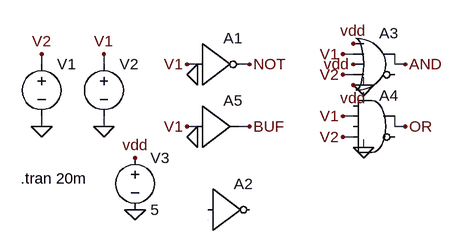
[diagram p0: schematic digitalSimulation.asc]
digitalSimulation.asc, the LTspice schematic file:
Version 4
SHEET 1 880 680
WIRE 64 48 48 48
WIRE -416 64 -416 48
WIRE -320 64 -320 48
WIRE -176 64 -192 64
WIRE -96 64 -112 64
WIRE 128 64 128 48
WIRE 144 64 128 64
WIRE 64 80 48 80
WIRE 64 144 48 144
WIRE -416 160 -416 144
WIRE -320 160 -320 144
WIRE -176 160 -192 160
WIRE -96 160 -112 160
WIRE 128 160 128 144
WIRE 144 160 128 160
WIRE 64 176 48 176
FLAG -192 64 V1
FLAG -192 160 V1
FLAG 48 48 V1
FLAG 48 80 V2
FLAG 48 144 V1
FLAG 48 176 V2
FLAG -96 64 NOT
FLAG -96 160 BUF
FLAG 144 64 AND
FLAG 144 160 OR
FLAG -320 48 V1
FLAG -416 48 V2
FLAG -320 160 0
FLAG -416 160 0
FLAG -176 80 0
FLAG -176 176 0
FLAG 80 96 0
FLAG 80 192 0
FLAG -272 208 vdd
FLAG -272 288 0
FLAG 64 32 vdd
FLAG 64 64 vdd
FLAG 64 96 vdd
SYMBOL voltage -416 48 R0
WINDOW 3 24 96 Invisible 2
WINDOW 123 0 0 Left 0
WINDOW 39 0 0 Left 0
SYMATTR Value PULSE(0 5 0 10p 10p 10m 20m)
SYMATTR InstName V1
SYMBOL voltage -320 48 R0
WINDOW 3 24 96 Invisible 2
WINDOW 123 0 0 Left 0
WINDOW 39 0 0 Left 0
SYMATTR Value PULSE(0 5 0 10p 10p 5m 10m)
SYMATTR InstName V2
SYMBOL Digital\\inv -176 0 R0
SYMATTR InstName A1
SYMBOL Digital\\inv -160 224 R0
SYMATTR InstName A2
SYMBOL Digital\\or 96 0 R0
SYMATTR InstName A3
SYMBOL Digital\\and 96 96 R0
SYMATTR InstName A4
SYMBOL Digital\\buf1 -176 96 R0
SYMATTR InstName A5
SYMBOL voltage -272 192 R0
WINDOW 123 0 0 Left 0
WINDOW 39 0 0 Left 0
SYMATTR InstName V3
SYMATTR Value 5
TEXT -448 240 Left 2 !.tran 20m

The netlist it stands for:
* digitalSimulation.asc
V1 V2 0 PULSE(0 5 0 10p 10p 10m 20m)
V2 V1 0 PULSE(0 5 0 10p 10p 5m 10m)
A1 V1 0 0 0 0 NOT 0 0 BUF
A2 0 0 0 0 0 0 0 0 BUF
A3 vdd V1 vdd V2 vdd 0 AND 0 OR
A4 0 V1 0 V2 0 0 OR 0 AND
A5 V1 0 0 0 0 0 BUF 0 BUF
V3 vdd 0 5
.tran 20m
.backanno
.end